# EAGLE design UKHASnet-avr-sensor (EAGLE 6.5.0)
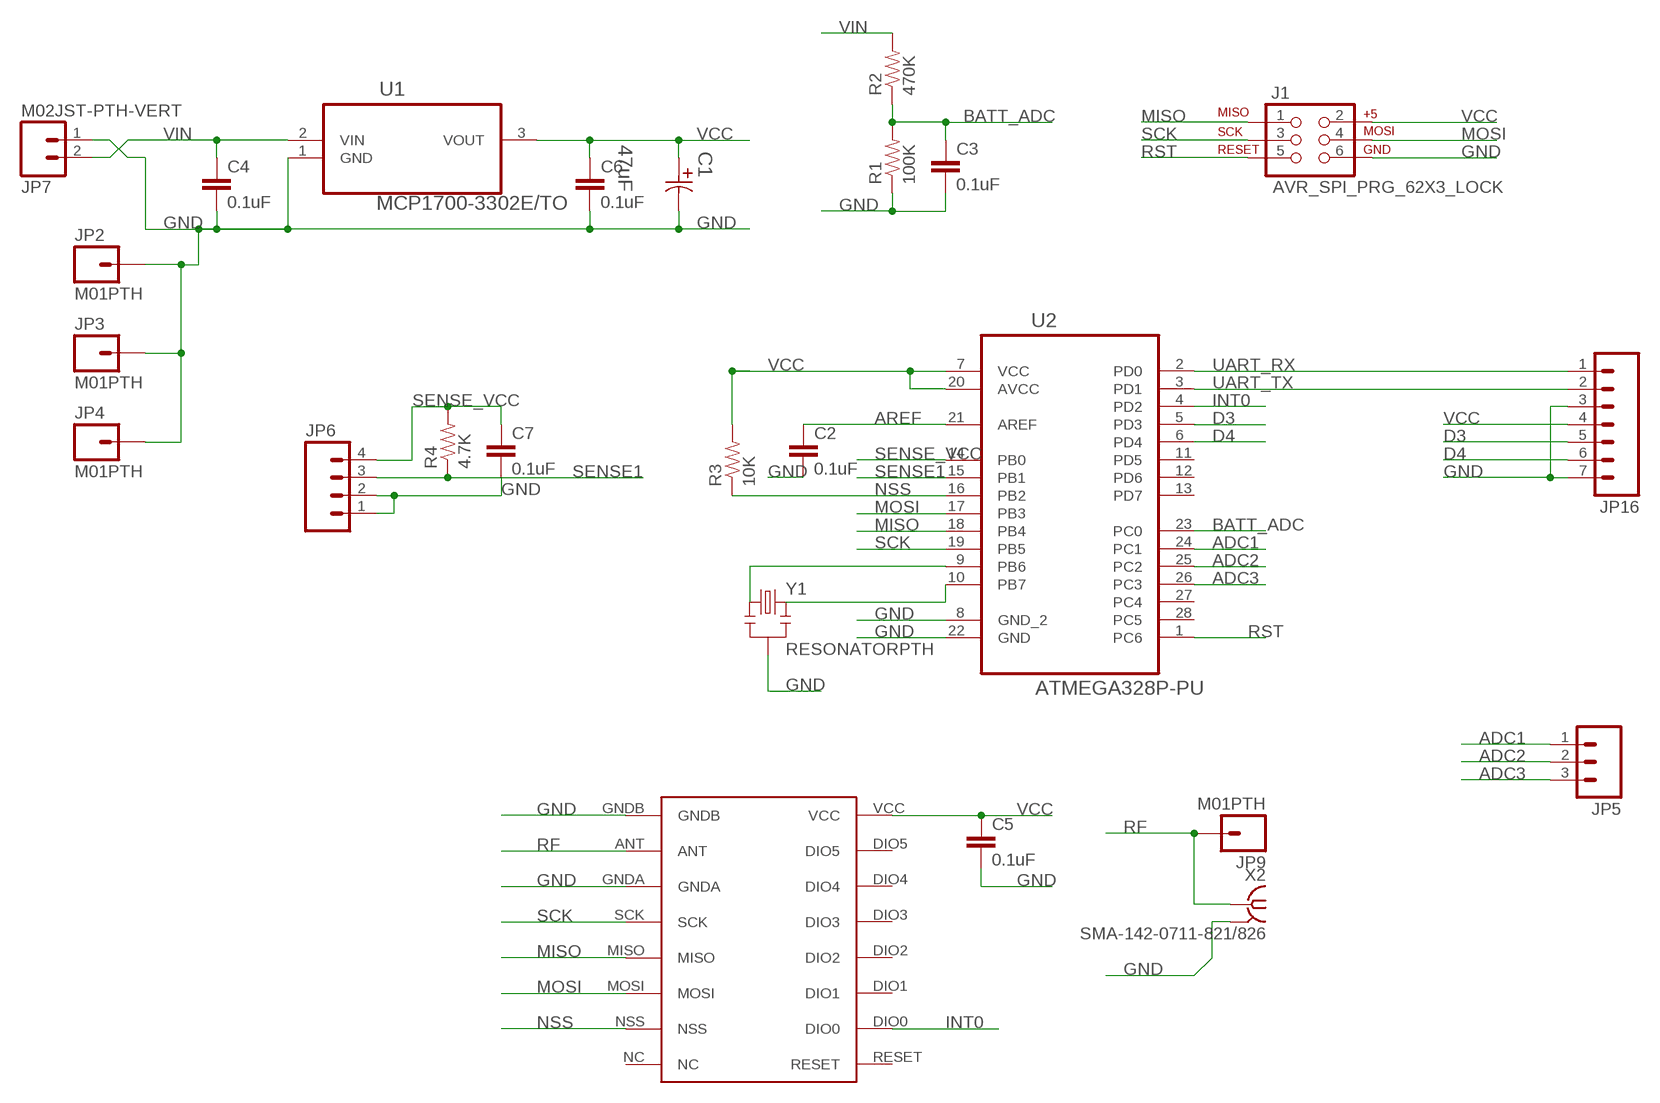
[diagram p0: schematic, sheet 1]

## Parts
C1  47uF  EEUFC1J6R8-P1.5  [CAPPR150-400X1200]
C2  0.1uF  C2.5/2  [C2.5-2]
C3  0.1uF  C2.5/2  [C2.5-2]
C4  0.1uF  C2.5/2  [C2.5-2]
C5  0.1uF  C2.5/2  [C2.5-2]
C6  0.1uF  C2.5/2  [C2.5-2]
C7  0.1uF  C2.5/2  [C2.5-2]
J1  AVR_SPI_PRG_62X3_LOCK  [2X3_LOCK]
JP2  M01PTH  [1X01]
JP3  M01PTH  [1X01]
JP4  M01PTH  [1X01]
JP5  M03PTH  [1X03]
JP6  M04PTH  [1X04]
JP7  M02JST-PTH-VERT  [JST-2-PTH-VERT]
JP9  M01PTH  [1X01]
JP16  M07  [1X07]
R1  100K  RESISTORPTH-1/4W  [AXIAL-0.4]
R2  470K  RESISTORPTH-1/4W  [AXIAL-0.4]
R3  10K  RESISTORPTH-1/4W  [AXIAL-0.4]
R4  4.7K  RESISTORPTH-1/4W  [AXIAL-0.4]
U1  MCP1700-3302E/TO  [TO127P254X495-3]
U2  ATMEGA328P-PU  [DIP254P762X457-28]
U$1  RFM69HW  [RFM]
X2  SMA-142-0711-821/826  [J502-ND-142-0711-821/826]
Y1  RESONATORPTH  [RESONATOR-PTH]

## Nets
ADC1: JP5.1 U2.24(PC1)
ADC2: JP5.2 U2.25(PC2)
ADC3: JP5.3 U2.26(PC3)
AREF: C2.1 U2.21(AREF)
BATT_ADC: C3.1 R1.P$2 R2.P$1 U2.23(PC0)
D3: JP16.5 U2.5(PD3)
D4: JP16.6 U2.6(PD4)
GND: C1.2 C2.2 C3.2 C4.2 C5.2 C6.2 C7.2 J1.6 JP2.1 JP3.1 JP4.1 JP6.1 JP6.2 JP7.1 JP16.3 JP16.7 R1.P$1 U1.1(GND) U2.8(GND_2) U2.22(GND) U$1.GNDA U$1.GNDB X2.G@1 X2.G@2 X2.G@3 X2.G@4 Y1.2
INT0: U2.4(PD2) U$1.DIO0
MISO: J1.1 U2.18(PB4) U$1.MISO
MOSI: J1.4 U2.17(PB3) U$1.MOSI
N$10: U2.10(PB7) Y1.3
N$11: U2.9(PB6) Y1.1
NSS: R3.P$1 U2.16(PB2) U$1.NSS
RF [RF]: JP9.1 U$1.ANT X2.1
RST: J1.5 U2.1(PC6)
SCK: J1.3 U2.19(PB5) U$1.SCK
SENSE1: JP6.3 R4.P$1 U2.15(PB1)
SENSE_VCC: C7.1 JP6.4 R4.P$2 U2.14(PB0)
UART_RX: JP16.1 U2.2(PD0)
UART_TX: JP16.2 U2.3(PD1)
VCC: C1.1 C5.1 C6.1 J1.2 JP16.4 R3.P$2 U1.3(VOUT) U2.7(VCC) U2.20(AVCC) U$1.VCC
VIN: C4.1 JP7.2 R2.P$2 U1.2(VIN)
Unconnected: U2.11(PD5) U2.12(PD6) U2.13(PD7) U2.27(PC4) U2.28(PC5) U$1.DIO1 U$1.DIO2 U$1.DIO3 U$1.DIO4 U$1.DIO5 U$1.NC U$1.RESET

## Library data of the parts
C1 = 1000ufCap:EEU: Aluminum Electrolytic Capacitors; MPN: EEUFC1J6R8; OC_FARNELL: 1848468; OC_NEWARK: 17T5110; RATEDVOLTAGE: 63V; SUPPLIER: PANASONIC; TOLERANCE: ±20 %; VALUE: 6.8UF
C2-C7 = capacitor-wima:C: CAPACITOR naming: grid - package width
J1 = SparkFun-Connectors:AVR_SPI_PRG_6: AVR ISP 6 Pin This is the reduced ISP connector for AVR programming. Common on Arduino. This footprint will take up less PCB space and can be used with a 10-pin to 6-pin adapter such as SKU: BOB-08508
JP2-JP4 JP9 = SparkFun-Connectors:M01: Header 1 Standard 1-pin 0.1" header. Use with straight break away headers (SKU : PRT-00116), right angle break away headers (PRT-00553), swiss pins (PRT-00743), machine pins (PRT-00117), and female headers (PRT-00115).
JP5 = SparkFun-Connectors:M03: Header 3 Standard 3-pin 0.1" header. Use with straight break away headers (SKU : PRT-00116), right angle break away headers (PRT-00553), swiss pins (PRT-00743), machine pins (PRT-00117), and female headers (PRT-00115). Molex polarized connector foot print use with SKU : PRT-08232 with associated crimp pins and housings.
JP6 = SparkFun-Connectors:M04: Header 4 Standard 4-pin 0.1" header. Use with straight break away headers (SKU : PRT-00116), right angle break away headers (PRT-00553), swiss pins (PRT-00743), machine pins (PRT-00117), and female headers (PRT-00115). Molex polarized connector foot print use with SKU : PRT-08231 with associated crimp pins and housings. 1MM SMD Version SKU: PRT-10208
JP7 = SparkFun-Connectors:M02: Standard 2-pin 0.1" header. Use with - straight break away headers ( PRT-00116) - right angle break away headers (PRT-00553) - swiss pins (PRT-00743) - machine pins (PRT-00117) - female headers (PRT-00115) Molex polarized connector foot print use with: PRT-08233 with associated crimp pins and housings. 2.54_SCREWTERM for use with PRT-10571. 3.5mm Screw Terminal footprints for PRT-08084 5mm Screw Terminal footprints for use with PRT-08432
JP16 = SparkFun-Connectors:M07: Header 7 Standard 7-pin 0.1" header. Use with straight break away headers (SKU : PRT-00116), right angle break away headers (PRT-00553), swiss pins (PRT-00743), machine pins (PRT-00117), and female headers (PRT-00115). NOTES ON THE VARIANTS LOCK and LOCK_LONGPADS... This footprint was designed to help hold the alignment of a through-hole component (i.e. 7-pin header) while soldering it into place. You may notice that each hole has been shifted either up or down by 0.005 of an inch from it's more standard position (which is usually a perfectly straight line). This slight alteration caused the pins (the squares in the middle) to touch the edges of the holes. Because they are alternating, it causes a "brace" to hold the header in place. 0.005 has proven to be the perfect amount of "off-center" position when using our standard breakaway headers. Although looks a little odd when you look at the bare footprint, once you have a header in there, the alteration is very hard to notice. Also, if you push a header all the way into place, it is covered up entirely on the bottom side. This idea of altering the position of holes to aid alignment will be further integrated into the Sparkfun Library for other footprints. It can help hold any component with 3 or more connection pins.
R1-R4 = SparkFun:RESISTOR: Resistor Basic schematic elements and footprints for 0603, 1206, and PTH resistors.
U1 = mcp1700:MCP1700-3302E/TO: IC, Low Quiescent Current LDO,3.3V,TO-92; MPN: MCP1700-3302E/TO; OC_FARNELL: 1296588; OC_NEWARK: 88H9804; PACKAGE: TO-92; SUPPLIER: Microchip
U2 = atmega328-dil:ATMEGA328P-PU: 8-bit Microcontroller with In-System Programmable Flash; MPN: ATMEGA328P-PU; OC_FARNELL: 1715487; OC_NEWARK: 15R0268; PACKAGE: PDIP-28; SUPPLIER: Atmel
U$1 = hopeRF2:RFM69HW
X2 = con-coax:SMA-: SMA 50 Ohm End Launch Jack Receptacle - Round Contact Johnson Components Source: www.johnsoncomponents.com .. J502-ND.pdf; MF: JOHNSON COMPONENTS; MPN: 142-0711-821; OC_FARNELL: 1019328; OC_NEWARK: 16F3627
Y1 = SparkFun:RESONATOR: Resonator Small SMD resonator. This is the itty bitty 10/20MHz resonators with built in caps. CSTCE10M0G55 and CSTCE20M0V53. Footprint has been reviewed closely but hasn't been tested yet.

## Net classes
1 RF: clearance 0.381 mm

## Board
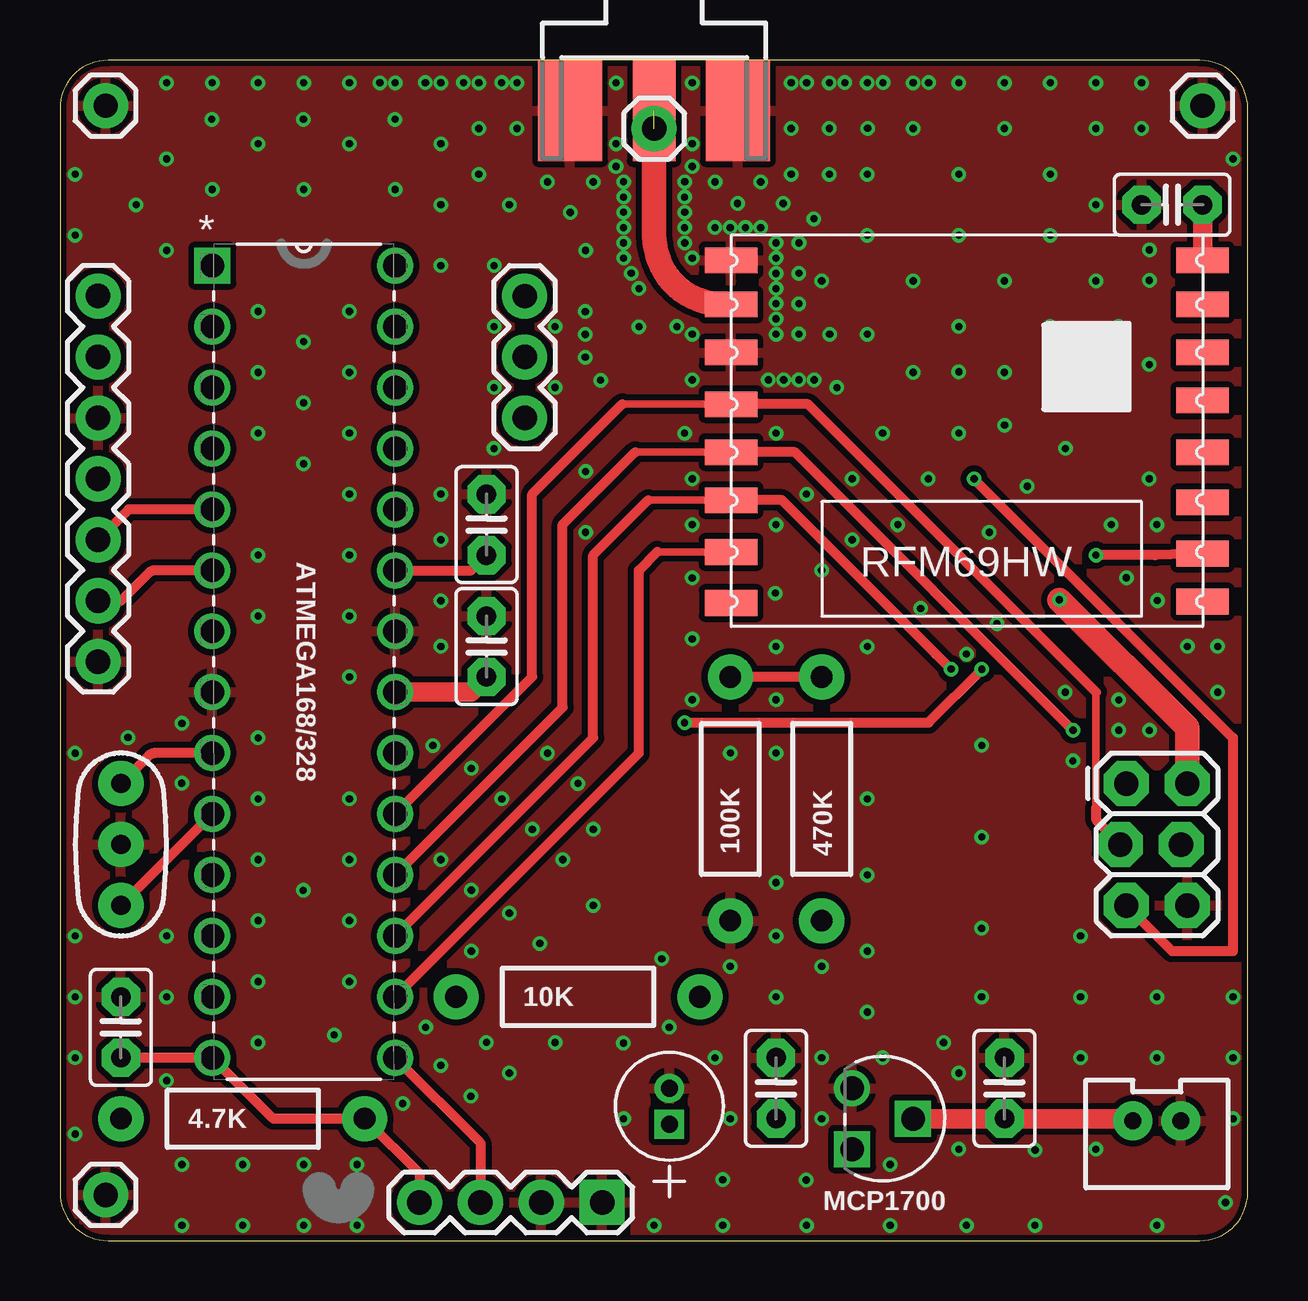
[diagram p1: board, top side]
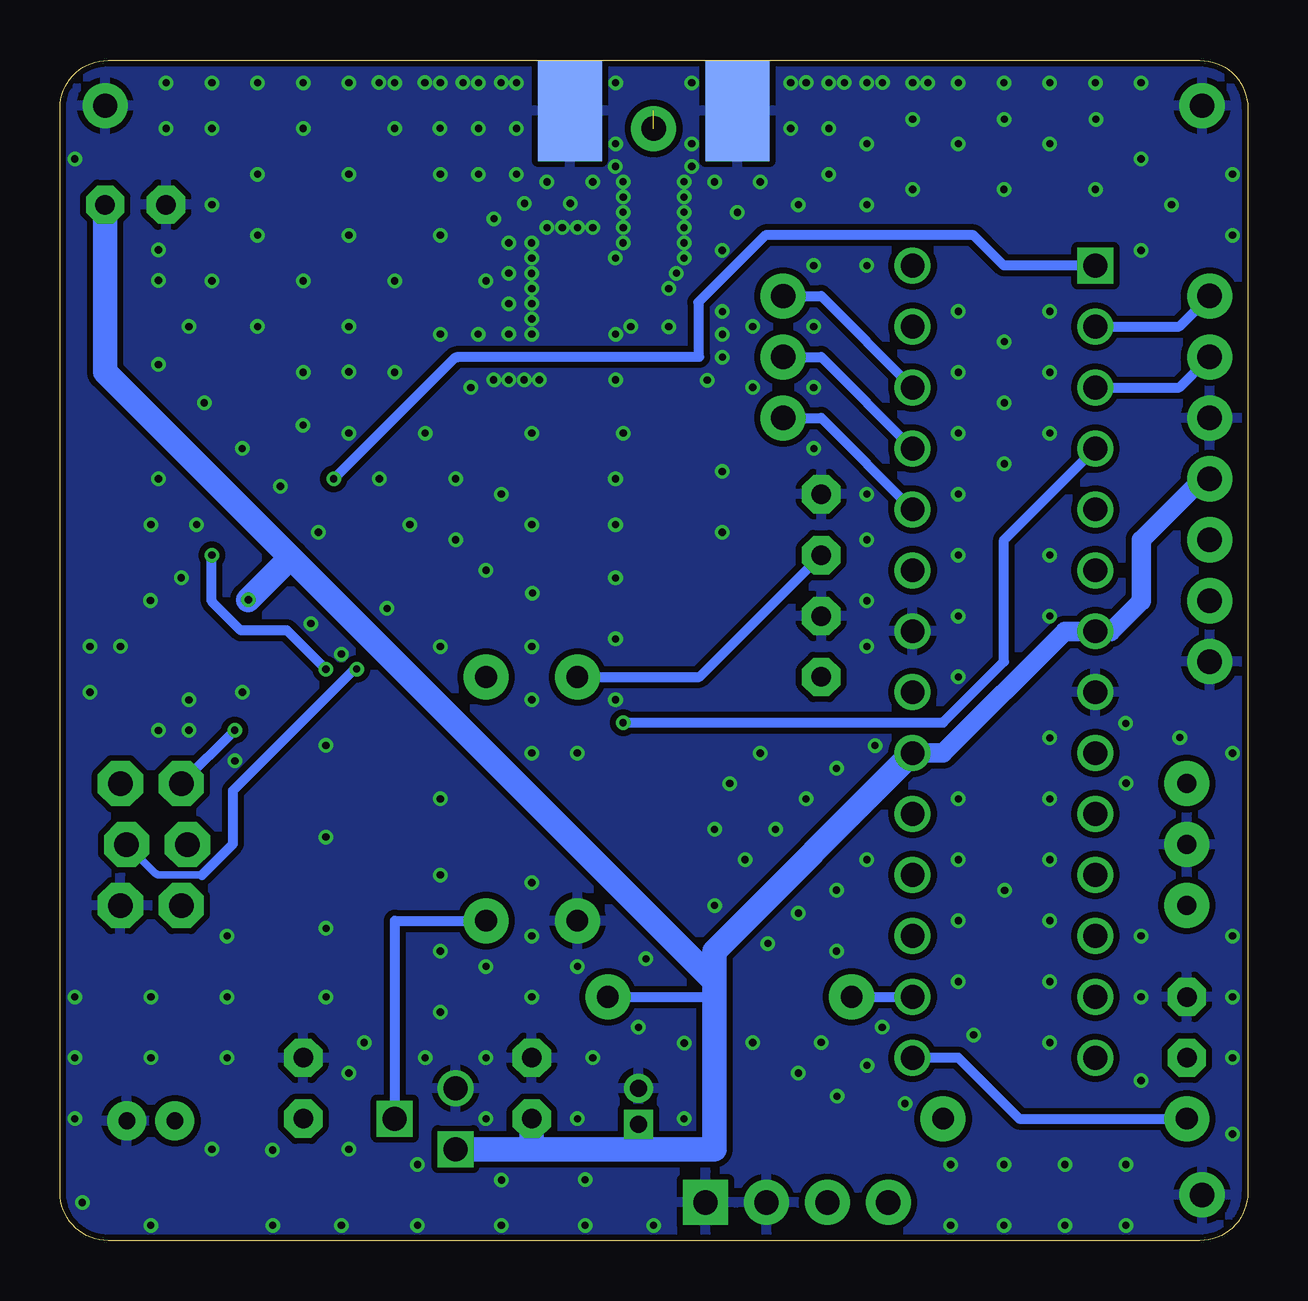
[diagram p2: board, bottom side, seen from below]

Size 49.51 x 49.21 mm. Coordinates in mm from the lower left corner, seen from the top.
Outline: 0,47.2 0,2 arc90 2,0 47.51,0 arc90 49.51,2 49.51,47.2 arc90 47.51,49.2 2,49.2 arc90 0,47.2
Copper layers (1*16): Top 0.035mm / dielectric 1.5mm / Bottom 0.035mm
Design rules "Hackvana": minimum track width 6mil, minimum drill 0.3mm, track to track 6mil, track to pad 6mil, pad to pad 6mil, via to via 6mil, smd to smd 0mil, copper to edge 6mil, drill to drill 6mil, minimum pad ring 10mil, minimum via ring 6mil, stop-mask expansion 2mil, vias tented up to drill 100mil, thermal gap 10mil

### Footprints (pad centres in the part's own frame; a part is rotated, then mirrored left to right if it is on the bottom)
CAPPR150-400X1200 = drill 0.711 square: 1 -1.499,0 | drill 0.711: 2 0,0
C2.5-2 = drill 0.813 pad 1.6 octagon: 1 -1.27,0; 2 1.27,0
2X3_LOCK = drill 1.016 pad 1.88 octagon: 1 0,0; 2 0,2.54; 3 2.54,-0.254; 4 2.54,2.286; 5 5.08,0; 6 5.08,2.54
1X01 = drill 1.016 pad 1.88: 1 0,0
1X03 = drill 1.016 pad 1.88: 1 0,0; 2 2.54,0; 3 5.08,0
1X04 = drill 1.016 pad 1.88 square: 1 0,0 | drill 1.016 pad 1.88: 2 2.54,0; 3 5.08,0; 4 7.62,0
JST-2-PTH-VERT = drill 0.7 pad 1.626: 1 -1,-0.55; 2 1,-0.55
1X07 = drill 1.016 pad 1.88: 1 0,0; 2 2.54,0; 3 5.08,0; 4 7.62,0; 5 10.16,0; 6 12.7,0; 7 15.24,0
AXIAL-0.4 = drill 0.9 pad 1.88: P$1 -5.08,0; P$2 5.08,0
TO127P254X495-3 = drill 0.991: 1 -2.54,-2.54 | drill 0.991 square: 2 -1.27,0; 3 0,-2.54
DIP254P762X457-28 = drill 0.991 square: 1 -7.62,33.02 | drill 0.991: 2 -7.62,30.48; 3 -7.62,27.94; 4 -7.62,25.4; 5 -7.62,22.86; 6 -7.62,20.32; 7 -7.62,17.78; 8 -7.62,15.24; 9 -7.62,12.7; 10 -7.62,10.16; 11 -7.62,7.62; 12 -7.62,5.08; 13 -7.62,2.54; 14 -7.62,0; 15 0,0; 16 0,2.54; 17 0,5.08; 18 0,7.62; 19 0,10.16; 20 0,12.7; 21 0,15.24; 22 0,17.78; 23 0,20.32; 24 0,22.86; 25 0,25.4; 26 0,27.94; 27 0,30.48; 28 0,33.02
RFM = smd 2.184 x 1.067: ANT 19.651,2.889; DIO0 0,13.27; DIO1 0,11.143; DIO2 0,9.047; DIO3 0,6.889; DIO4 0,4.889; DIO5 0,2.889; GNDA 19.651,4.889; GNDB 19.651,1.048; MISO 19.651,9.047; MOSI 19.651,11.047; NC 19.651,15.334; NSS 19.651,13.206; RESET 0,15.27; SCK 19.651,7.048; VCC 0,1.048
J502-ND-142-0711-821/826 = smd 4.191 x 1.778: 1 2.115,0 | smd 4.191 x 2.667: G@1 2.115,3.495; G@2 2.115,-3.495 | smd 4.191 x 2.667 bottom: G@3 2.115,3.495; G@4 2.115,-3.495
RESONATOR-PTH = drill 0.8 pad 1.88: 1 -2.54,0; 2 0,0; 3 2.54,0

### Placement (x,y rotation side)
C1  25.4,6.35 90 top
C2  17.78,24.77 90 top
C3  17.78,29.84 90 top
C4  39.37,6.35 90 top
C5  46.35,43.18 180 top
C6  29.84,6.35 90 top
C7  2.54,8.89 90 top
J1  44.45,19.05 270 top
JP2  1.91,1.91 0 top
JP3  47.62,47.31 0 top
JP4  1.91,47.31 0 top
JP5  19.37,34.29 90 top
JP6  22.6,1.59 180 top
JP7  45.72,4.45 180 top
JP9  24.77,46.35 0 top
JP16  1.59,39.37 270 top
R1  27.94,18.41 90 top
R2  31.75,18.41 270 top
R3  21.59,10.16 0 top
R4  7.62,5.08 0 top
U1  35.56,3.81 270 top
U2  13.97,7.62 0 top
U$1  47.62,41.91 180 top
X2  24.77,49.21 270 top
Y1  2.54,16.51 270 top

### Tracks (layer width: path | path; a pad name or v marks a point on that pad's centre or on a via)
ADC1
  Bottom 0.406: JP5.1 17.78,34.29 U2.24
ADC2
  Bottom 0.406: JP5.2 17.78,36.83 U2.25
ADC3
  Bottom 0.406: JP5.3 17.78,39.37 U2.26
AREF
  Top 0.813: U2.21 17.14,22.86 C2.1
BATT_ADC
  Top 0.406: R2.P$1 R1.P$2 | U2.23 17.14,27.94 C3.1
  Bottom 0.406: R1.P$2 22.86,23.49 C3.1
D3
  Top 0.406: U2.5 2.86,30.48 JP16.5
D4
  Top 0.406: U2.6 3.94,27.94 arc45 3.72,27.85 2.54,26.67 JP16.6 1.59,26.99
GND  (via drill 0.3)
  other vias: 10.16,43.81 0.64,20.32 0.64,12.7 4.45,12.7 0.64,10.16 4.45,48.26 6.35,48.26 8.26,48.26 10.16,48.26 12.06,48.26 13.97,48.26 15.88,48.26 19.05,48.26 19.05,46.35 18.73,43.18 23.5,43.5 26.04,43.5 29.85,41.59 33.67,46.37 25.72,38.1 29.84,37.78 29.84,39.69 26.04,42.23 30.48,44.45 30.48,46.35 30.48,48.26 33.66,48.26 35.56,48.26 37.47,48.26 39.37,48.26 41.27,48.26 43.18,48.26 45.09,48.26 15.88,45.72 12.06,45.72 8.26,45.72 4.45,45.09 13.97,43.81 6.35,43.81 0.64,44.45 0.64,41.91 3.17,43.18 4.45,41.27 8.26,38.73 12.06,38.73 8.26,36.2 12.06,36.2 8.26,33.66 12.06,33.66 12.06,31.11 8.26,28.57 12.06,28.57 12.06,26.04 8.26,20.95 8.26,18.41 12.06,18.41 8.26,15.88 12.06,15.88 12.06,23.5 8.26,26.04 8.26,13.34 12.06,13.34 8.26,10.79 12.06,10.79 11.43,8.57 8.26,8.26 0.64,7.62 0.64,4.45 5.08,0.64 7.62,0.64 10.16,0.64 12.38,0.64 10.15,46.74 4.45,6.67 5.07,19.07 24.77,0.64 27.3,7.62 27.62,0.64 31.11,0.64 34.61,0.64 5.08,21.56 37.78,0.64 40.64,0.64 45.72,0.64 48.9,5.08 48.9,7.62 48.9,10.16 37.47,3.81 34.61,3.17 37.47,6.99 38.42,13.02 45.72,10.16 45.72,7.62 35.56,46.35 39.37,46.35 43.18,46.35 41.27,44.45 37.47,44.45 33.66,44.45 33.66,41.91 37.47,41.91 41.27,41.91 31.75,40.01 35.56,40.01 39.37,40.01 43.18,40.01 33.66,37.78 37.47,38.1 41.27,38.1 43.5,34.92 39.37,36.2 35.56,36.2 37.47,33.66 41.91,33.02 45.41,31.75 45.4,36.52 43.82,29.84 45.72,29.84 32.38,35.56 34.29,33.66 38.74,29.53 36.2,31.75 48.26,24.77 48.26,22.86 29.53,35.88 26.35,35.88 21.91,32.06 44.13,38.1 4.45,10.16 23.5,42.23 7.62,3.17 12.38,3.17 15.87,7.3 18.73,6.98 20.64,8.26 2.83,20.97 17.14,14.61 15.88,15.88 18.41,18.41 19.68,17.14 17.14,19.68 20,12.38 18.73,13.65 17.14,12.06 21.59,19.05 20.32,20.32 20.64,35.57 21.91,29.53 15.88,26.67 15.88,29.21 15.88,24.77 26.35,29.84 26.35,31.75 31.11,31.11 35.88,26.35 33.02,29.21 33.66,24.76 31.75,27.94 29.84,29.84 29.84,24.76 26.35,27.62 37.78,24.45 40.65,3.78 27.94,20.32 29.84,12.7 22.23,17.14 20.95,15.88 22.23,13.97 33.66,9.53 10.14,14.6 15.54,20.64 23.49,8.24 29.85,22.54 29.85,14.92 29.84,20.32 45.74,26.68 39.38,33.99 33.66,18.41 17.12,6.02 42.55,10.16 42.55,7.62 48.58,1.59 31.42,42.6 38.42,10.16 42.55,12.7 31.11,2.53 33.66,15.24 37.47,36.22 29.84,10.16 46.99,24.77 40.32,31.44 44.45,27.62 44.13,22.54 29.84,33.66 26.04,33.66 18.09,33.02 33.02,31.75 34.92,29.84 39.05,25.72 45.41,21.27 44.13,21.27 27.94,5.08 25.08,11.75 23.5,5.08 25.4,8.89 27.94,11.43 31.75,11.43 31.75,7.62 31.75,5.08 20.64,38.1 21.91,41.27 21.27,42.86 18.1,40.64 15.88,40.64 18.1,38.1 18.1,35.56 10.15,37.47 10.15,34.92 10.15,32.38 15.88,31.11 26.35,22.54 15.88,43.18 26.35,25.08 45.09,46.35 48.9,45.09 43.18,43.18 29.84,40.96 23.18,48.26 23.18,45.72 22.23,44.13 26.35,48.26 26.35,45.72 27.3,44.13 23.5,40.96 6.33,46.74 15.24,8.89 13.97,46.74 14.29,5.72 17.78,8.26 33.65,12.06 27.62,2.54 34.29,7.62 36.83,8.26 10.16,3.17 5.08,3.17 20.32,44.13 17.46,48.26 17.46,46.35 17.46,44.45 29.21,44.13 32.07,46.35 32.07,48.26 32.07,44.45 43.18,3.81 38.42,16.82 38.42,20.64 41.9,22.86 29.82,26.99 42.22,20 45.41,40.02 29.85,40.32 27.3,42.23 27.94,42.23 28.57,42.23 26.35,37.78 29.84,39.06 29.84,38.42 24.13,39.69 23.81,40.32 23.5,41.59 23.5,42.86 23.5,44.14 26.36,40.96 26.04,41.59 26.04,42.86 26.04,44.14 26.36,44.77 23.18,44.77 32.08,37.78 30.15,43.23 28.24,43.23 31.12,48.27 32.71,48.27 34.3,48.27 36.21,48.27 18.41,48.27 16.82,48.27 15.23,48.27 13.33,48.26 45.41,41.29 30.8,40.32 30.8,39.05 30.8,37.79 30.8,41.59 29.21,42.23 22.53,35.87 21.9,36.82 21.9,38.73 21.9,37.77 30.16,35.88 30.8,35.88 31.43,35.88 24.13,38.1
  pour Bottom (isolate 0.254): -1.27,50.8 52.07,50.8 52.07,-2.54 -1.27,-2.54
  pour Top (isolate 0.254): -1.27,50.8 52.07,50.8 52.07,-2.54 -1.27,-2.54
INT0  (via drill 0.3)
  Top 0.406: U$1.DIO0 45.66,28.57 v43.18,28.57 | v26.04,21.59 36.2,21.59 v38.42,23.82
  Bottom 0.406: v38.42,23.82 40.05,25.44 41.98,25.44 43.18,26.64 v43.18,28.57 | v26.04,21.59 12.7,21.59 10.16,24.13 10.16,29.21 U2.4
MISO  (via drill 0.3)
  Top 0.305: U$1.MISO 23.97,32.86
  Top 0.406: U2.18 20.95,22.23 20.95,29.84 23.97,32.86 | v42.23,21.27 30.64,32.86 U$1.MISO
  Bottom 0.406: v42.23,21.27 J1.1
MOSI  (via drill 0.3)
  Top 0.305: U$1.MOSI 24.51,30.86
  Top 0.406: U2.17 22.23,20.95 22.23,28.57 24.51,30.86 | v37.14,23.83 36.51,24.45 30.1,30.86 U$1.MOSI
  Bottom 0.305: J1.4 45.56,15.33 arc-45 45.33,15.24 43.59,15.24 | 37.21,23.76 v37.14,23.83
  Bottom 0.406: 43.59,15.24 42.29,16.54 42.29,18.76 37.23,23.83 v37.14,23.83
N$10
  Top 0.406: U2.10 Y1.3
N$11
  Top 0.406: U2.9 3.94,20.32 arc45 3.72,20.23 Y1.1
NSS
  Top 0.305: U$1.NSS 24.89,28.7
  Top 0.406: U2.16 24.13,20.32 24.13,27.94 24.89,28.7
  Bottom 0.406: R3.P$1 U2.16
RF  (1 unrouted)
  Top 1.016: U$1.ANT 27.65,39.02 arc-90 24.77,41.91 JP9.1
RST  (via drill 0.3)
  Top 0.406: v38.1,31.75 48.9,20.95 48.9,12.06 46.35,12.06 J1.5
  Bottom 0.406: U2.1 10.16,40.64 11.43,41.91 20.1,41.91 22.9,39.11 22.9,36.86 22.86,36.83 32.89,36.83 arc-45 33.11,36.74 v38.1,31.75
SCK
  Top 0.305: 43.18,22.86 43.18,18.03 | U$1.SCK 23.43,34.86
  Top 0.406: U2.19 19.68,23.5 19.68,31.11 23.43,34.86 | U$1.SCK 31.18,34.86 43.18,22.86 | 43.18,18.03 43.18,17.66 arc45 43.27,17.43 J1.3
SENSE1
  Top 0.406: U2.15 17.52,4.07 JP6.3
  Bottom 0.406: U2.15 12.06,7.62 9.53,5.08 R4.P$1
SENSE_VCC
  Top 0.406: C7.1 U2.14 8.89,5.08 R4.P$2 14.98,2.8 JP6.4
UART_RX
  Bottom 0.406: U2.2 2.86,38.1 JP16.1
UART_TX
  Bottom 0.406: U2.3 2.86,35.56 JP16.2
VCC  (via drill 0.3)
  Top 0.813: U$1.VCC C5.1
  Top 1.016: J1.2 46.99,21.38 v41.66,26.71
  Bottom 0.406: R3.P$2 22.23,10.16
  Bottom 0.813: U2.20 12.7,20.32 7.62,25.4 U2.7 5.71,25.4 4.45,26.67 4.45,29.21 1.9,31.75 JP16.4
  Bottom 1.016: C5.1 47.62,36.21 39.89,28.48 | U1.3 29.84,3.81 | 29.84,3.81 25.4,3.81 | 25.4,3.81 22.23,3.81 22.23,10.16 22.23,10.81 | C1.1 25.4,3.81 | U2.20 22.23,12.06 22.23,10.81 | C6.1 29.84,3.81 | 39.89,28.48 22.23,10.81 | v41.66,26.71 39.89,28.48
VIN
  Top 0.813: U1.2 C4.1 44.63,5.08 JP7.2
  Bottom 0.406: U1.2 35.56,13.33 R2.P$2

### Text on the board
tPlace: ATMEGA168/328 | MCP1700
tDocu: RX | A3 | TX | A2 | G | A1 | + | D3 | D4 | G | https://ukhas.net/ | Sensor V3 | Phil M0DNY | 18B20/DHT22 | max 6V
200bmp: /home/phil/Dropbox/Shared/Icons/4.bmp | /home/phil/Dropbox/Shared/Icons/4.bmp
211bmp: /home/phil/Dropbox/Shared/Icons/4.bmp
215bmp: /home/phil/Dropbox/Shared/Icons/4.bmp